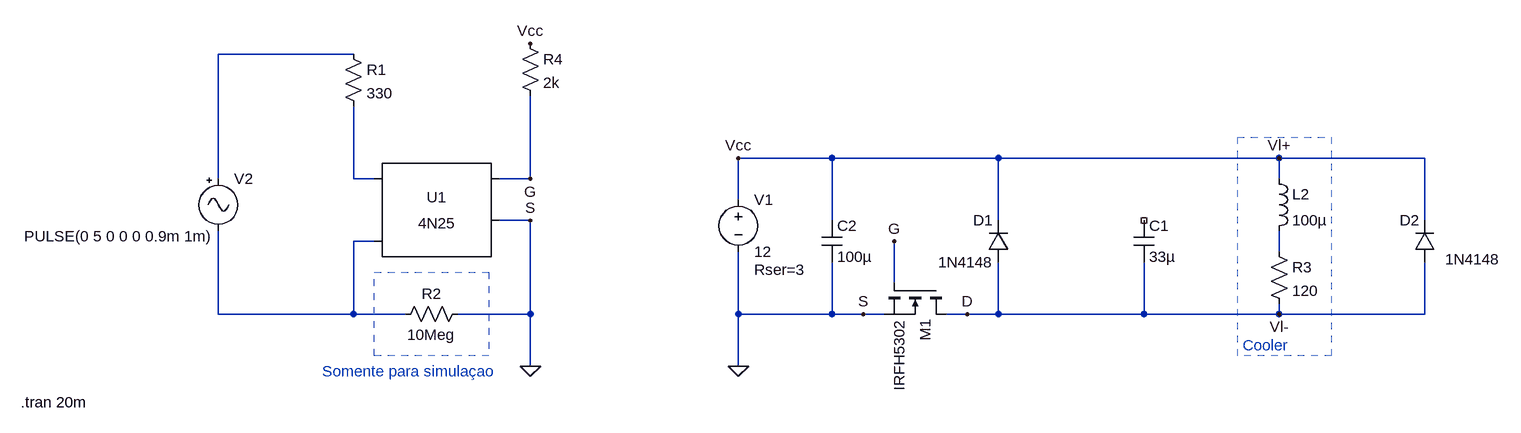
[diagram p0: schematic PWM isolado.asc]
PWM isolado.asc, the LTspice schematic file:
Version 4
SHEET 1 1160 680
WIRE -608 -128 -816 -128
WIRE 128 32 -16 32
WIRE 384 32 128 32
WIRE 816 32 384 32
WIRE 1040 32 816 32
WIRE -816 64 -816 -128
WIRE -608 64 -608 -48
WIRE -576 64 -608 64
WIRE -336 64 -336 -64
WIRE -336 64 -384 64
WIRE 816 64 816 32
WIRE -16 96 -16 32
WIRE -336 128 -384 128
WIRE 128 128 128 32
WIRE 384 128 384 32
WIRE 1040 128 1040 32
WIRE -576 160 -608 160
WIRE 816 176 816 144
WIRE 224 224 224 160
WIRE -816 272 -816 144
WIRE -608 272 -608 160
WIRE -608 272 -816 272
WIRE -528 272 -608 272
WIRE -336 272 -336 128
WIRE -336 272 -448 272
WIRE -16 272 -16 176
WIRE 128 272 128 192
WIRE 128 272 -16 272
WIRE 176 272 128 272
WIRE 208 272 176 272
WIRE 336 272 304 272
WIRE 384 272 384 192
WIRE 384 272 336 272
WIRE 608 272 608 192
WIRE 608 272 384 272
WIRE 816 272 816 256
WIRE 816 272 608 272
WIRE 1040 272 1040 192
WIRE 1040 272 816 272
WIRE -336 352 -336 272
WIRE -16 352 -16 272
FLAG -16 352 0
FLAG 224 160 G
FLAG 176 272 S
FLAG 336 272 D
FLAG -336 352 0
FLAG -16 32 Vcc
FLAG -336 -144 Vcc
FLAG -336 64 G
FLAG -336 128 S
FLAG 816 32 Vl+
FLAG 816 272 Vl-
SYMBOL nmos 304 224 R90
SYMATTR InstName M1
SYMATTR Value IRFH5302
SYMBOL Optos\\4N25 -480 128 R0
SYMATTR InstName U1
SYMBOL res -624 -144 R0
SYMATTR InstName R1
SYMATTR Value 330
SYMBOL res -432 256 R90
WINDOW 0 0 56 VBottom 2
WINDOW 3 32 56 VTop 2
SYMATTR InstName R2
SYMATTR Value 10Meg
SYMBOL res 800 160 R0
SYMATTR InstName R3
SYMATTR Value 120
SYMBOL voltage -16 80 R0
WINDOW 123 0 0 Left 0
WINDOW 39 24 124 Left 2
SYMATTR SpiceLine Rser=3
SYMATTR InstName V1
SYMATTR Value 12
SYMBOL res -352 -160 R0
SYMATTR InstName R4
SYMATTR Value 2k
SYMBOL Misc\\signal -816 48 R0
WINDOW 3 -299 104 Left 2
WINDOW 123 0 0 Left 0
WINDOW 39 0 0 Left 0
SYMATTR Value PULSE(0 5 0 0 0 0.9m 1m)
SYMATTR InstName V2
SYMBOL diode 400 192 R180
WINDOW 0 24 64 Left 2
WINDOW 3 24 0 Left 2
SYMATTR InstName D1
SYMATTR Value 1N4148
SYMBOL ind 800 48 R0
SYMATTR InstName L2
SYMATTR Value 100µ
SYMBOL diode 1056 192 R180
WINDOW 0 24 64 Left 2
WINDOW 3 -100 4 Left 2
SYMATTR InstName D2
SYMATTR Value 1N4148
SYMBOL cap 592 128 R0
SYMATTR InstName C1
SYMATTR Value 33µ
SYMBOL cap 112 128 R0
SYMATTR InstName C2
SYMATTR Value 100µ
TEXT -1120 408 Left 2 !.tran 20m
TEXT 760 320 Left 2 ;Cooler
TEXT -656 360 Left 2 ;Somente para simulaçao
LINE Normal 752 336 752 0 2
LINE Normal 896 336 752 336 2
LINE Normal 896 0 896 336 2
LINE Normal 752 0 896 0 2
RECTANGLE Normal -400 336 -576 208 2

The netlist it stands for:
* PWM isolado.asc
M1 Vl- G 0 0 IRFH5302
XU1 N002 N003 G 0 NC_01 4N25
R1 N001 N002 330
R2 0 N003 10Meg
R3 N004 Vl- 120
V1 Vl+ 0 12 Rser=3
R4 Vl+ G 2k
V2 N001 N003 PULSE(0 5 0 0 0 0.9m 1m)
D1 Vl- Vl+ 1N4148
L2 Vl+ N004 100µ
D2 Vl- Vl+ 1N4148
C1 NC_02 Vl- 33µ
C2 Vl+ 0 100µ
.model D D
.lib standard.dio
.model NMOS NMOS
.model PMOS PMOS
.lib standard.mos
.tran 20m
* Cooler
* Somente para simulaçao
.lib 4N25.sub
.backanno
.end